# Altium schematic sheet Power.SchDoc
size A3; SheetNumber: 3; SheetTotal: 8; DocumentSheetName: Power
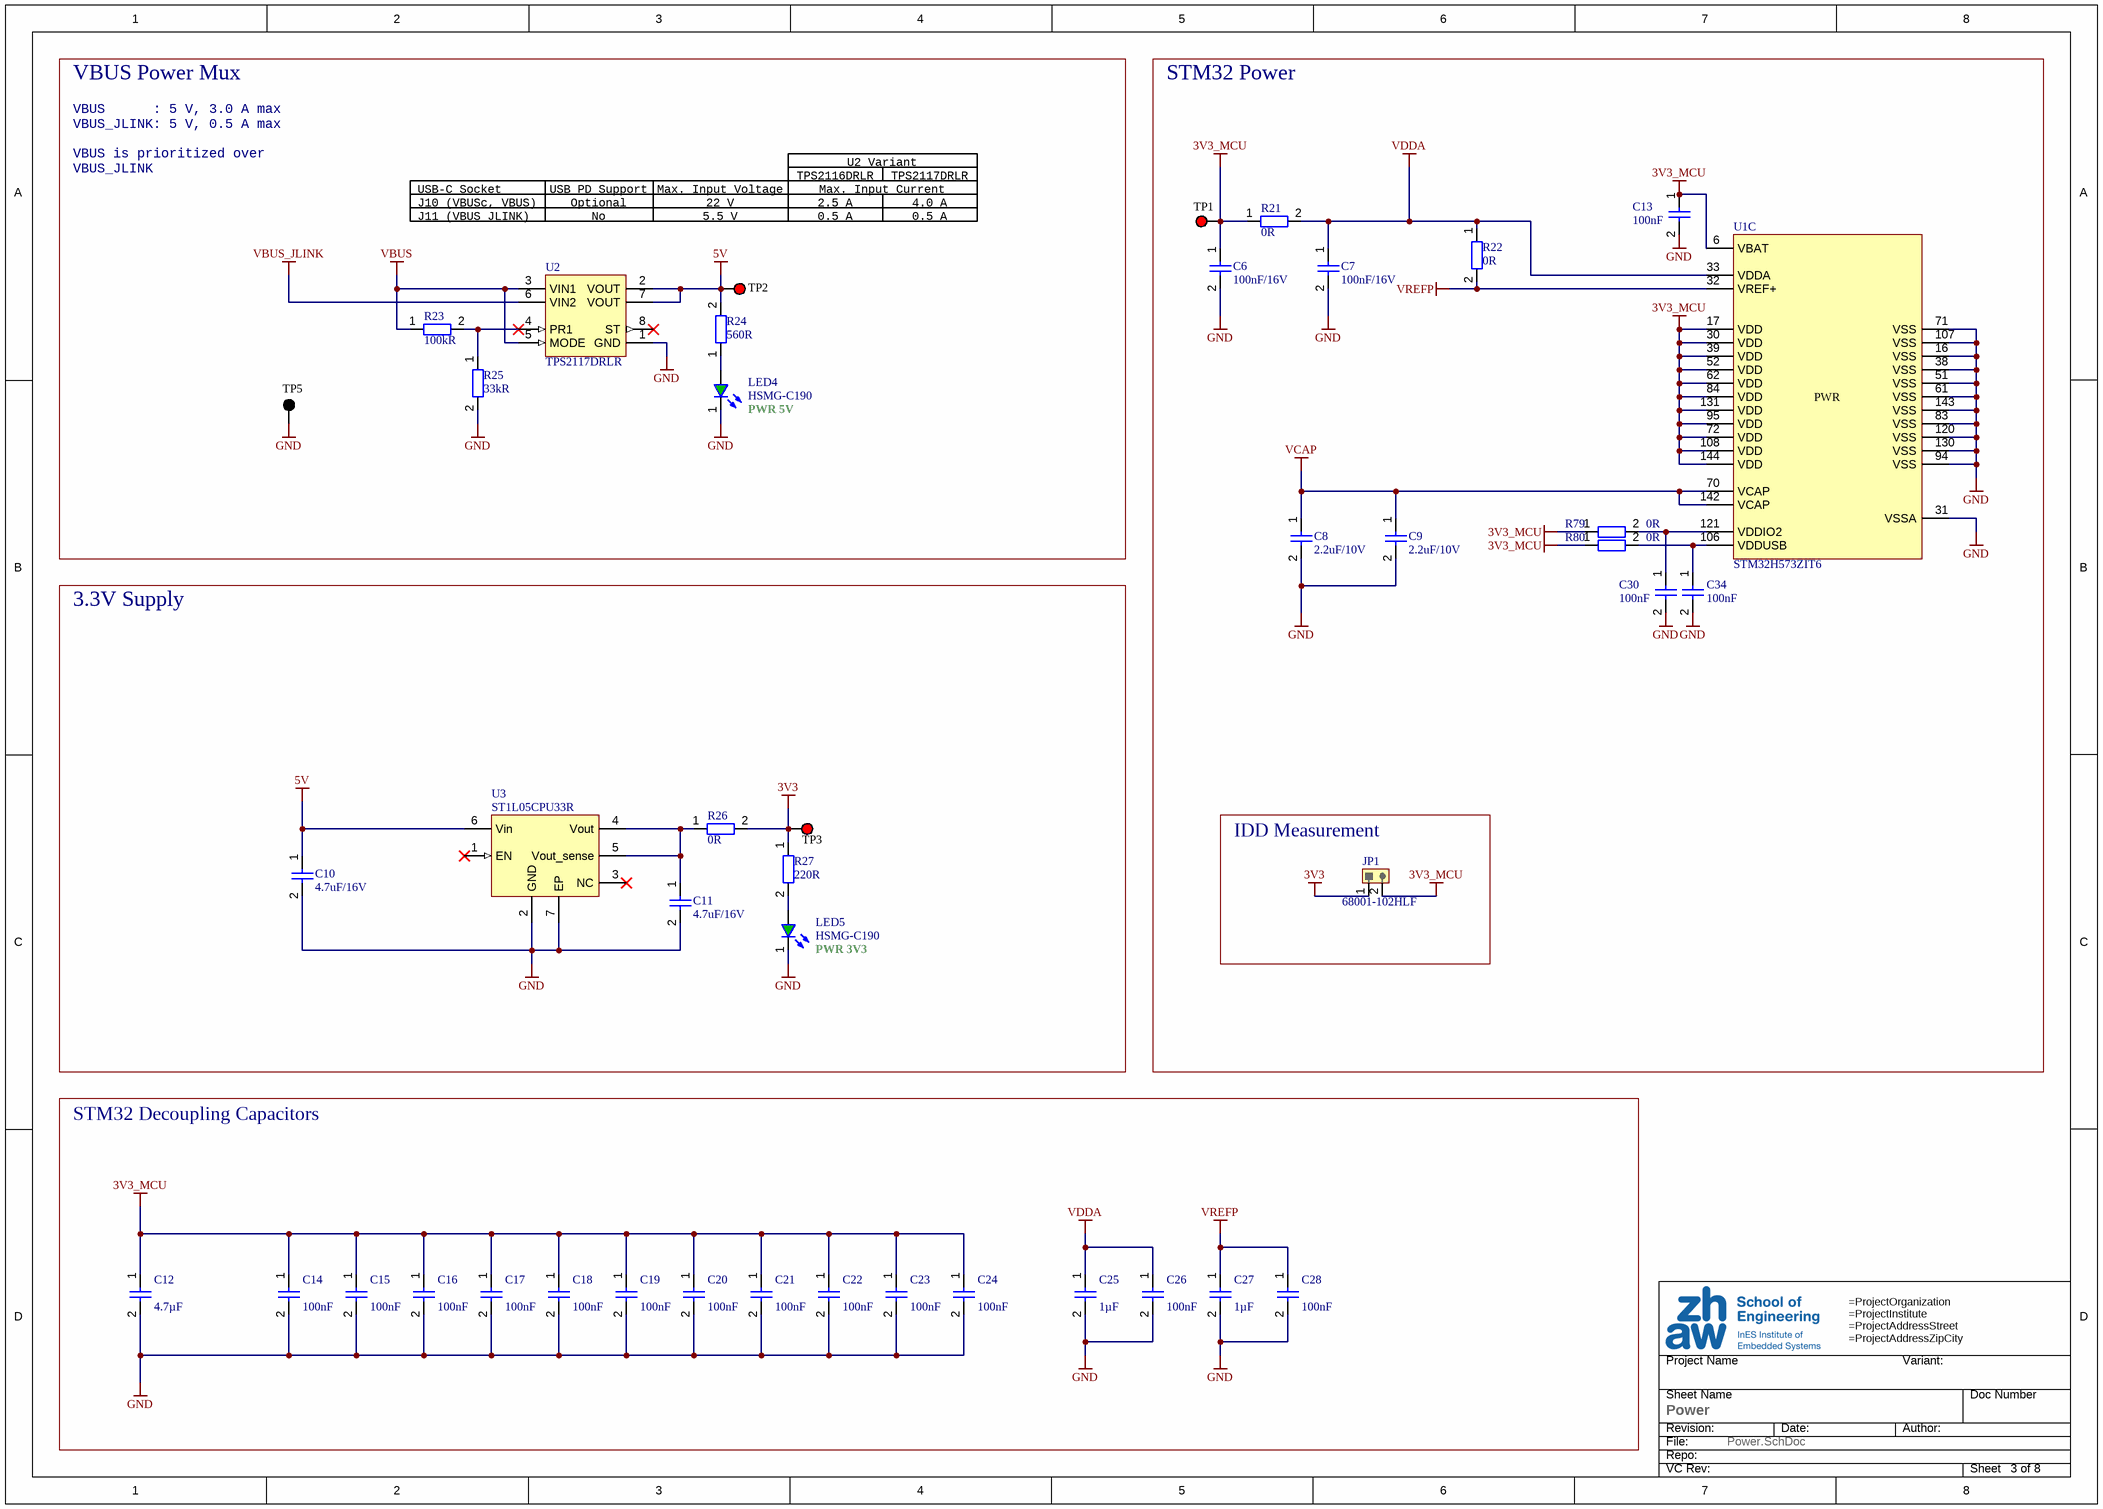
[diagram p0: Power.SchDoc]

## Parts
C6  100nF/16V  [CAPC1005X50N]
C7  100nF/16V  [CAPC1005X50N]
C8  2.2uF/10V  [CAPC1608X80N]
C9  2.2uF/10V  [CAPC1608X80N]
C10  4.7uF/16V  [CAPC1608X80N]
C11  4.7uF/16V  [CAPC1608X80N]
C12  value 4.7µF  [CAPC1608X80N]  (hidden comment: 4.7uF/16V)
C13  value 100nF  [CAPC1005X50N]  (hidden comment: 100nF/16V)
C14  value 100nF  [CAPC1005X50N]  (hidden comment: 100nF/16V)
C15  value 100nF  [CAPC1005X50N]  (hidden comment: 100nF/16V)
C16  value 100nF  [CAPC1005X50N]  (hidden comment: 100nF/16V)
C17  value 100nF  [CAPC1005X50N]  (hidden comment: 100nF/16V)
C18  value 100nF  [CAPC1005X50N]  (hidden comment: 100nF/16V)
C19  value 100nF  [CAPC1005X50N]  (hidden comment: 100nF/16V)
C20  value 100nF  [CAPC1005X50N]  (hidden comment: 100nF/16V)
C21  value 100nF  [CAPC1005X50N]  (hidden comment: 100nF/16V)
C22  value 100nF  [CAPC1005X50N]  (hidden comment: 100nF/16V)
C23  value 100nF  [CAPC1005X50N]  (hidden comment: 100nF/16V)
C24  value 100nF  [CAPC1005X50N]  (hidden comment: 100nF/16V)
C25  value 1µF  [CAPC1608X80N]  (hidden comment: 1uF/16V)
C26  value 100nF  [CAPC1005X50N]  (hidden comment: 100nF/16V)
C27  value 1µF  [CAPC1608X80N]  (hidden comment: 1uF/16V)
C28  value 100nF  [CAPC1005X50N]  (hidden comment: 100nF/16V)
C30  value 100nF  [CAPC1005X50N]  (hidden comment: 100nF/16V)
C34  value 100nF  [CAPC1005X50N]  (hidden comment: 100nF/16V)
JP1  68001-102HLF  [HD254 _1x2_MV]
LED4  HSMG-C190  [LEDSC160X80X80-2Lgn]
LED5  HSMG-C190  [LEDSC160X80X80-2Lgn]
R21  0R  [RESC1608X45N]
R22  0R  [RESC1608X45N]
R23  100kR  [RESC1608X45N]
R24  560R  [RESC1608X45N]
R25  33kR  [RESC1608X45N]
R26  0R  [RESC1608X45N_JUMPER]
R27  220R  [RESC1608X45N]
R79  0R  [RESC1005X35N_JUMPER]
R80  0R  [RESC1005X35N_JUMPER]
TP1  5000  [KSTN-5000]  (value not drawn)
TP2  5000  [KSTN-5000]  (value not drawn)
TP3  5000  [KSTN-5000]  (value not drawn)
TP5  5001  [KSTN-5001]  (value not drawn)
U1  STM32H573ZIT6  [LQFP50P2200X2200X160-144N]  (part C of 3)
U2  TPS2117DRLR  [SOTFL50P160X60-8L]
U3  ST1L05CPU33R  [SON95P300X95-7T250X160L]

## Blocks framed on the sheet
VBUS Power Mux: LED4 R23-R25 TP2 TP5 U2
STM32 Power: C6-C9 C13 C30 C34 R21 R22 R79 R80 TP1 U1
3.3V Supply: C10 C11 LED5 R26 R27 TP3 U3
IDD Measurement: JP1
STM32 Decoupling Capacitors: C12 C14-C28

## Nets
3V3: JP1.1 R26.2 R27.1 TP3.1
3V3_MCU: C6.1 C12.1 C13.1 C14.1 C15.1 C16.1 C17.1 C18.1 C19.1 C20.1 C21.1 C22.1 C23.1 C24.1 JP1.2 R21.1 R79.1 R80.1 TP1.1 U1.6(VBAT) U1.17(VDD) U1.30(VDD) U1.39(VDD) U1.52(VDD) U1.62(VDD) U1.72(VDD) U1.84(VDD) U1.95(VDD) U1.108(VDD) U1.131(VDD) U1.144(VDD)
5V: C10.1 R24.2 TP2.1 U2.2(VOUT) U2.7(VOUT) U3.6(Vin)
GND: C6.2 C7.2 C8.2 C9.2 C10.2 C11.2 C12.2 C13.2 C14.2 C15.2 C16.2 C17.2 C18.2 C19.2 C20.2 C21.2 C22.2 C23.2 C24.2 C25.2 C26.2 C27.2 C28.2 C30.2 C34.2 LED4.1(K) LED5.1(K) R25.2 TP5.1 U1.16(VSS) U1.31(VSSA) U1.38(VSS) U1.51(VSS) U1.61(VSS) U1.71(VSS) U1.83(VSS) U1.94(VSS) U1.107(VSS) U1.120(VSS) U1.130(VSS) U1.143(VSS) U2.1(GND) U3.2(GND) U3.7(EP)
VBUS: R23.1 U2.3(VIN1) U2.5(MODE)
VBUS_JLINK: U2.6(VIN2)
VCAP: C8.1 C9.1 U1.70(VCAP) U1.142(VCAP)
VDDA: C7.1 C25.1 C26.1 R21.2 R22.1 U1.33(VDDA)
VREFP: C27.1 C28.1 R22.2 U1.32(VREF+)
NetC11_1: C11.1 R26.1 U3.4(Vout) U3.5(Vout_sense)
NetC30_1: C30.1 R79.2 U1.121(VDDIO2)
NetC34_1: C34.1 R80.2 U1.106(VDDUSB)
NetLED4_2: LED4.2(A) R24.1
NetLED5_2: LED5.2(A) R27.2
NetR23_2: R23.2 R25.1 U2.4(PR1)

Not connected (* = marked no-connect by the designer): U2 8(ST)*; U3 1(EN)* 3(NC)*

## Notes on the sheet
- VBUS      : 5 V, 3.0 A max
  VBUS_JLINK: 5 V, 0.5 A max
  VBUS is prioritized over VBUS_JLINK
- U2 Variant
- TPS2116DRLR
- TPS2117DRLR
- USB-C Socket
- J10 (VBUSc, VBUS)
- J11 (VBUS_JLINK)
- USB PD Support
- Optional
- No
- Max. Input Voltage
- 22 V
- 5.5 V
- Max. Input Current
- 2.5 A
- 0.5 A
- 4.0 A
- (near LED4) PWR 5V
- (near LED5) PWR 3V3
- Sheet Name
- Project Name
- Variant:
- Doc Number
- File:
- Repo:
- Revision:
- Date:
- Author:
- VC Rev:
- Sheet
- (in symbol CMP-00715-8, part C) PWR

## Library data of the parts
C6 C7 C13-C24 C26 C28 C30 C34 = CMP-001-00001-22: Cap MLCC, 100nF, 16V, X7R, 5%,  0402; Dielectricum: X7R; Type: MLCC; Case Code (Metric): 1005; Voltage Rating: 16V; Case/Package: 0402; Mounting Technology: SMD; Tolerance: 5%
  C6 C7: Value: 100nF
C8 C9 = CMP-00353-4: Cap MLCC, 2.2uF, 10V, X7R, 10%, 0603; Value: 2.2µF; Case Code (Metric): 1608; Case/Package: 0603; Tolerance: 10%; Mounting Technology: SMD; Type: MLCC; Dielectricum: X7R; Voltage Rating: 10V
C10 C11 = CMP-00443-4: Cap MLCC, 4.7uF, 16V, X7R, 10%, 0603; Value: 4.7µF; Voltage Rating: 16V; Mounting Technology: SMD; Tolerance: 10%; Case/Package: 0603; Type: MLCC; Case Code (Metric): 1608; Dielectricum: X7R
C12 = CMP-00443-4: Cap MLCC, 4.7uF, 16V, X7R, 10%, 0603; Voltage Rating: 16V; Mounting Technology: SMD; Tolerance: 10%; Case/Package: 0603; Type: MLCC; Case Code (Metric): 1608; Dielectricum: X7R
C25 C27 = CMP-001-00004-21: Cap MLCC, 1uF, 16V, X7R, 10%, 0603; Type: MLCC; Mounting Technology: SMD; Case Code (Metric): 1608; Tolerance: 10%; Dielectricum: X7R; Case/Package: 0603; Voltage Rating: 16V
JP1 = CMP-002-00102-13: Header, 1x2 Pin, Pitch 2.54mm, Male, Vertical, THT; Manufacturer: FCI; Mating Length: 5.84mm; Overall Contact Length: 11.43mm; Plating: Gold; Gender: Male; Insulation Height: 2.54mm; Pitch: 2.54mm; Mounting Technology: THT; Angle: Vertical; Pin Mapping: 1x2; Pins: 2; Termination Length: 3.05mm; Pitch Row: 2.54mm
LED4 LED5 = CMP-007-00013-24: LED, Green, 20mA, 2.2V, 0603; Case/Package: 0603; Rated Current: 20mA; Forward Voltage: 2.2V; Size: L1.6B0.8H0.8; Color: Green; Mounting Technology: SMD
R21 R22 = CMP-009-00006-33: Res, 0R, 1%, 0.1W, 0603; Value: 0; Voltage Rating: 75V; Power: 100mW; Type: Fixed; Case Code (Metric): 1608; Tolerance: 1%; Case/Package: 0603; Mounting Technology: SMD
R23 = CMP-009-00023-34: Res, 100kR, 1%, 0.1W, 0603; Power: 100mW; Value: 100k; Voltage Rating: 50V; Mounting Technology: SMD; Case/Package: 0603; Tolerance: 1%; Case Code (Metric): 1608; Type: Fixed
R24 = CMP-00862-1: Res, 560R, 1%, 100mW, 0603; Voltage Rating: 75V; Value: 560; Tolerance: 1%; Case/Package: 0603; Mounting Technology: SMD; Type: Fixed; Power: 100mW; Case Code (Metric): 1608
R25 = CMP-009-00580-5: Res, 33kR, 1%, 0.1W, 0603; Power: 100mW; Voltage Rating: 75V; Value: 33k; Mounting Technology: SMD; Tolerance: 1%; Case/Package: 0603; Case Code (Metric): 1608; Type: Fixed
R26 = CMP-009-00006-33: Res, 0R, 1%, 0.1W, 0603; Voltage Rating: 75V; Value: 0; Power: 100mW; Tolerance: 1%; Type: Fixed; Case Code (Metric): 1608; Mounting Technology: SMD; Case/Package: 0603
R27 = CMP-009-00452-5: Res, 220R, 1%, 0.1W, 0603; Voltage Rating: 75V; Value: 220; Temperature Coefficient: 100ppm/°C; Power: 100mW; Mounting Technology: SMD; Case Code (Metric): 1608; Case/Package: 0603; Tolerance: 1%; Type: Fixed
R79 R80 = CMP-009-00148-34: Res, 0R, 1%, 0.063W, 0402; Value: 0; Power: 63mW; Voltage Rating: 50V; Case/Package: 0402; Tolerance: 1%; Mounting Technology: SMD; Case Code (Metric): 1005; Type: Fixed
TP1-TP3 = CMP-00067-9: Test Point, Red, D2.5H4.6, THT, closed ring D1.25; Mounting Technology: THT; Color: Red; Size: D2.5H4.6
TP5 = CMP-00068-8: Test Point, Black, D2.5H4.6, THT, closed ring D1.25; Color: Black; Size: D2.5H4.6; Mounting Technology: THT
U1 = CMP-00715-8: Microcontroller, STM32, ARM Cortex-M33, 250MHz, Flash 2MB, RAM 640kB, 32bit, LQFP-144; Bit: 32; Min Supply Voltage: 1.71V; Max Supply Voltage: 3.6V; Frequency: 250MHz; Size: L20B20H1.6; Type: Microcontroller; RAM Size: 640kB; Case/Package: LQFP-144; Family: STM32, ARM Cortex-M33; Flash Size: 2MB; Mounting Technology: SMD
U2 = CMP-00817-5: Power MUX, 1.6V..5.5V, Power 1.6V..5V, 4A, SOT-583; Min Logic Voltage: 1.6V; Max Power Voltage: 5.5V; Mounting Technology: SMD; Function: Power MUX; Min Power Voltage: 1.6V; Case/Package: SOT-583; Max Logic Voltage: 5.5V; Size: L2.1B1.2H0.6; Max Current: 4A
U3 = CMP-00717-5: LinReg, Fixed, 3.3V, 1.3A, 5.5Vin, 300mV Dropout, DFN-6; Max Out Voltage: 3.3825V; Max In Voltage: 5.5V; Min Out Voltage: 3.2175V; Size: L3B3H0.9; Type: Fixed; Case/Package: DFN-6; Mounting Technology: SMD; Max Out Current: 1.3A; Dropout Voltage: 300mV